# Altium schematic sheet communication.SchDoc
size A4; SheetNumber: 8
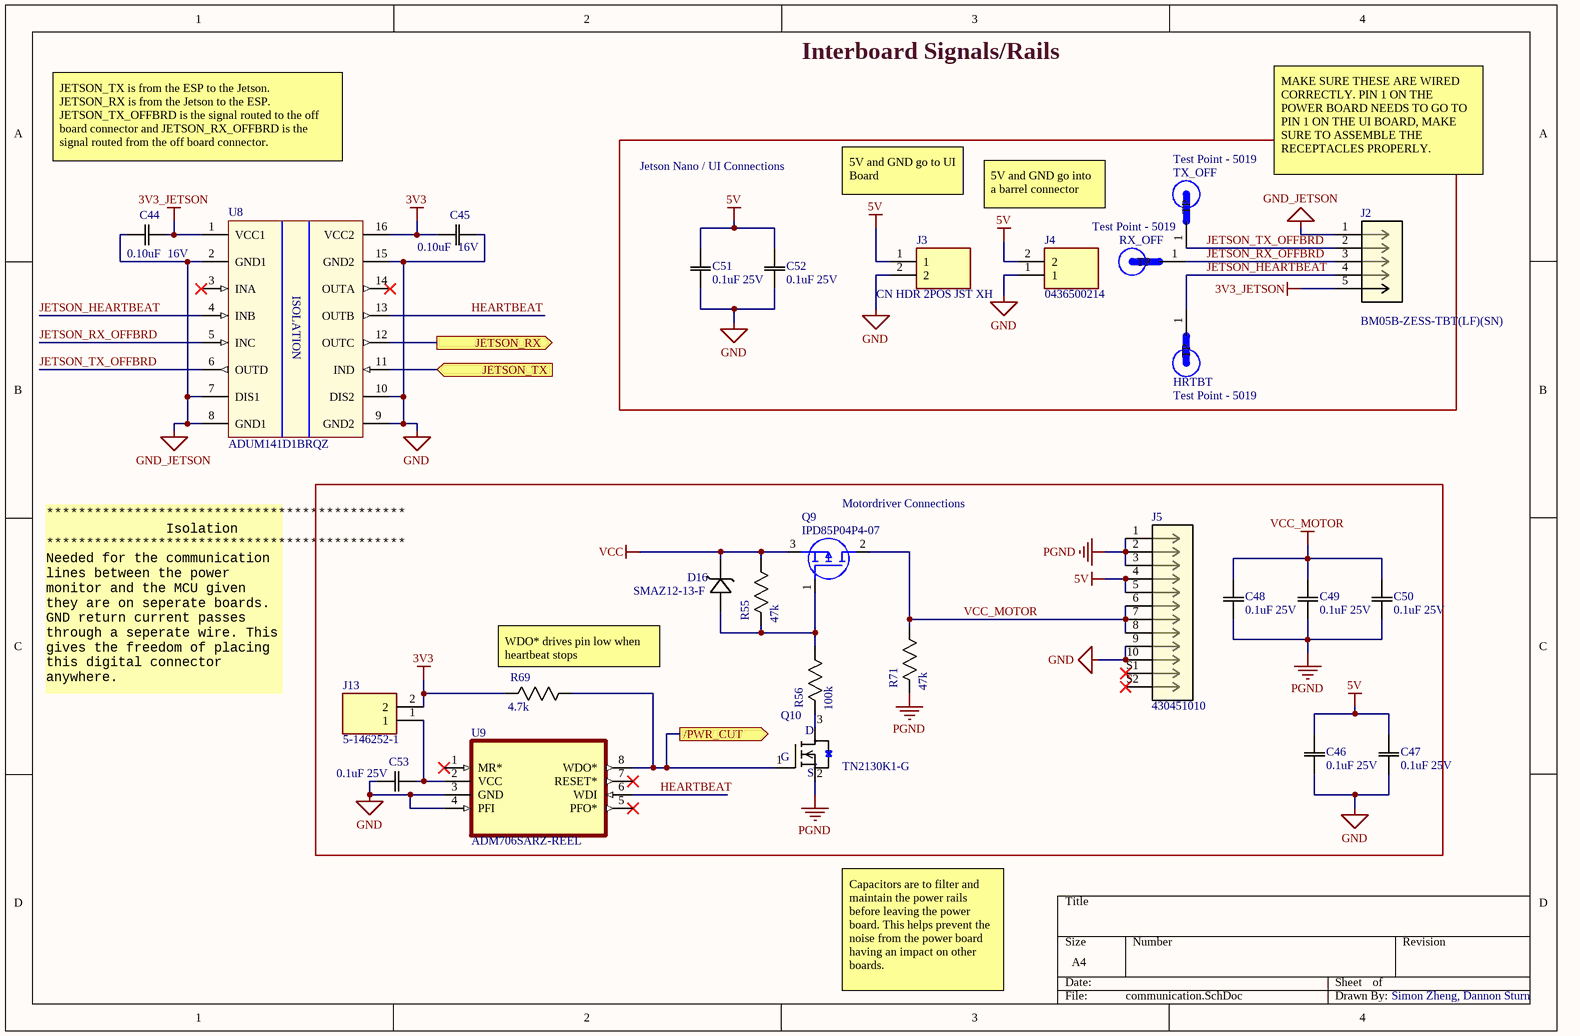
[diagram p0: communication.SchDoc]

## Parts
C44  Rating: 16V  [0603]  (hidden comment: 0.10uF)
C45  Rating: 16V  [0603]  (hidden comment: 0.10uF)
C46  0.1uF 25V  [0603]
C47  0.1uF 25V  [0603]
C48  0.1uF 25V  [0603]
C49  0.1uF 25V  [0603]
C50  0.1uF 25V  [0603]
C51  0.1uF 25V  [0603]
C52  0.1uF 25V  [0603]
C53  0.1uF 25V  [0603]
D16  SMAZ12-13-F  [SMA_DIO-L]
HRTBT  Test Point - 5019  [TP380X203]
J2  BM05B-ZESS-TBT(LF)(SN)  [JST ZE SMT 5POS]
J3  CN HDR 2POS JST XH  [JST_B2B-XH-A(LF)(SN)]
J4  0436500214  [43650-0214]
J5  430451010  [CON_430451010_MOL]
J13  5-146252-1  [TE_5-146252-1]
Q9  IPD85P04P4-07  [DPAK (TO-252)]
Q10  TN2130K1-G  [SOT95P237X112-3N]
R55  47k  [0603]
R56  100k  [0603]
R69  4.7k  [0603]
R71  47k  [0603]
RX_OFF  Test Point - 5019  [TP380X203]
TX_OFF  Test Point - 5019  [TP380X203]
U8  ADUM141D1BRQZ  [SOP64P600X175-16N]
U9  ADM706SARZ-REEL  [SOIC127P600X175-8N]

## Blocks framed on the sheet
Jetson Nano / UI Connections: C51 C52 HRTBT J2-J4 RX_OFF TX_OFF
Motordriver Connections: C46-C50 C53 D16 J5 J13 Q9 Q10 R55 R56 R69 R71 U9

## Ports
/PWR_CUT (out), JETSON_RX (out), JETSON_TX (in)

## Nets
3V3: C45.2(C2) J13.2 R69.2(R2) U8.16(VCC2)
3V3_JETSON: C44.2(C2) J2.5 U8.1(VCC1)
5V: C46.2(C2) C47.2(C2) C51.2(C2) C52.2(C2) J3.1 J4.2 J5.4 J5.5
GND: C45.1(C1) C46.1(C1) C47.1(C1) C51.1(C1) C52.1(C1) C53.1(C1) J3.2 J4.1 J5.9 J5.10 U8.9(GND2) U8.10(DIS2) U8.15(GND2) U9.3(GND) U9.4(PFI)
GND_JETSON: C44.1(C1) J2.1 U8.2(GND1) U8.7(DIS1) U8.8(GND1)
PGND: C48.1(C1) C49.1(C1) C50.1(C1) J5.1 J5.2 J5.3 Q10.2(S) R71.2(R2)
VCC: D16.1 Q9.3(S) R55.1(R1)
VCC_MOTOR: C48.2(C2) C49.2(C2) C50.2(C2) J5.6 J5.7 J5.8 Q9.2(D) R71.1(R1)
/PWR_CUT: Q10.1(G) R69.1(R1) U9.8(WDO*) ; port /PWR_CUT
HEARTBEAT: U8.13(OUTB) U9.6(WDI)
JETSON_HEARTBEAT: HRTBT.1(TP) J2.4 U8.4(INB)
JETSON_RX: U8.12(OUTC) ; port JETSON_RX
JETSON_RX_OFFBRD: J2.3 RX_OFF.1(TP) U8.5(INC)
JETSON_TX: U8.11(IND) ; port JETSON_TX
JETSON_TX_OFFBRD: J2.2 TX_OFF.1(TP) U8.6(OUTD)
NetC53_2: C53.2(C2) J13.1 U9.2(VCC)
NetD16_2: D16.2 Q9.1(G) R55.2(R2) R56.1(R1)
NetQ10_3: Q10.3(D) R56.2(R2)

Not connected (* = marked no-connect by the designer): J5 S1* S2*; U8 3(INA)* 14(OUTA)*; U9 1(MR*)* 5(PFO*)* 7(RESET*)*

## Notes on the sheet
- Interboard Signals/Rails
- JETSON_TX is from the ESP to the Jetson. JETSON_RX is from the Jetson to the ESP.
  JETSON_TX_OFFBRD is the signal routed to the off board connector and JETSON_RX_OFFBRD is the signal routed from the off board connector.
- MAKE SURE THESE ARE WIRED CORRECTLY. PIN 1 ON THE POWER BOARD NEEDS TO GO TO PIN 1 ON THE UI BOARD, MAKE SURE TO ASSEMBLE THE RECEPTACLES PROPERLY.
- 5V and GND go to UI Board
- 5V and GND go into a barrel connector
- *********************************************
  Isolation
  *********************************************
  Needed for the communication lines between the power monitor and the MCU given they are on seperate boards. GND return current passes through a seperate wire. This gives the freedom of placing this digital connector anywhere.
- (near R69) WDO* drives pin low when heartbeat stops
- Capacitors are to filter and maintain the power rails before leaving the power board. This helps prevent the noise from the power board having an impact on other boards.
- Simon Zheng, Dannon Sturn
- (in symbol ISO ADUM141D1BRQZ) ISOLATION

## Library data of the parts
C44 C45 = CAP 0.10uF 16V: CAP CER 0.10UF 16V X5R 0603/0805; Tolerance: 10%; Package: 0603/0805; Temperature Coefficient: X5R; Operating Temperature: -55°C ~ 85°C; Value: 0.10uF
C46-C53 = CAP 0.1uF 25V: CAP CER 0.1UF 25V X7R 0805/0603; Tolerance: 10%; Value: 0.1uF; Temperature Coefficient: X7R; Rating: 25V; Operating Temperature: -55°C ~ 125°C
D16 = DIODE ZENER 12V 1W: Zener Diode 12 V 1 W ±5% Surface Mount SMA; Mfr_Name: Diodes Inc; Type: DEV; Copyright: Copyright (C) 2021 Ultra Librarian. All rights reserved.; Manufacturer_Part_Number: SMAZ12-13-F; Digi-Key_Part_Number_1: SMAZ12-FDICT-ND; Digi-Key_Part_Number_2: SMAZ12-FDIDKR-ND; Digi-Key_Part_Number_3: SMAZ12-FDITR-ND; RefDes: RefDes; Supplier 1: Mouser; Supplier 2: Newark; Supplier 3: Digi-Key; Supplier Part Number 1: 621-SMAZ12-F; Supplier Part Number 2: 23T8541; Supplier Part Number 3: SMAZ12-FDICT-ND
HRTBT RX_OFF TX_OFF = Test Point - 5019: PC Test Point, Miniature Phosphor Bronze, Silver Plating Surface Mount Mounting Type; MP: 5019; MF: Keystone Electronics; Value: *; Package: 2010 Keystone; Digi-Key_Part_Number: 36-5019CT-ND; Digi-Key_Purchase_URL: https://www.digikey.com/product-detail/en/keystone-electronics/5019/36-5019CT-ND/3907344?utm_source=snapeda&utm_medium=aggregator&utm_campaign=symbol
J2 = CN 5POS JST ZE SMT: CONN HEADER VERT SMD 5POS ZE; Supplier 1: Digi-Key; Supplier Part Number 1: 455-2383-1-ND
J3 = CN HDR 2POS JST XH: Connector Header Through Hole 2 position 0.098 _2.50mm_ / JST XH; MP: B2B-XH-A_LF__SN_; MF: JST Sales; Price: None; Package: None; Value: *; Availability: Unavailable; SnapEDA_Link: https://www.snapeda.com/parts/B2B-XH-A%28LF%29%28SN%29/JST%20Sales%20America%20Inc./view-part/492310/?ref=snap
J4 = CN HDR 2POS Molex 0436500214: Connector Header Surface Mount, Right Angle 2 position 0.118" (3.00mm); Manufacturer_Name: Molex; Datasheet Link: http://www.molex.com/webdocs/datasheets/pdf/en-us//0436500214_PCB_HEADERS.pdf; Manufacturer_Part_Number: 43650-0214; Supplier 1: Digi-Key; Supplier 2: Newark; Supplier 3: Arrow Electronics; Supplier 4: Mouser; Supplier Part Number 1: WM14310CT-ND; Supplier Part Number 2: 39AH6218; Supplier Part Number 3: 43650-0214; Supplier Part Number 4: 538-43650-0214
J5 = CN HDR 10POS MOLEX 430451010: Connector Header Surface Mount, Right Angle 10 position 0.118" (3.00mm); Mfr_Name: Molex Connector Corporation; Copyright: Copyright (C) 2021 Ultra Librarian. All rights reserved.; Manufacturer_Part_Number: 430451010; Digi-Key_Part_Number_1: WM3819TR-ND; Digi-Key_Part_Number_2: WM3819CT-ND; Digi-Key_Part_Number_3: WM3819DKR-ND; RefDes: RefDes; Type: DEV; Supplier 1: Digi-Key; Supplier 2: Newark; Supplier 3: Mouser; Supplier Part Number 1: WM3819CT-ND; Supplier Part Number 2: 03AH4054; Supplier Part Number 3: 538-43045-1010
J13 = 5-146252-1: 2 Pin Jumper Male Pins; Package: None; Price: None; Value: *; MP: 5-146252-1; Availability: Unavailable
Q9 = MOSFET IPD85P04P4-07: P-Channel 40 V 85A (Tc) 88W (Tc) Surface Mount PG-TO252-3-313; Supplier 1: Newark; Supplier 2: Mouser; Supplier 3: Digi-Key; Supplier Part Number 1: 51AH5912; Supplier Part Number 2: 726-IPD85P04P4-07; Supplier Part Number 3: 448-IPD85P04P407ATMA1CT-ND
Q10 = MOSFET N-CH TN2130K1-G: N-Channel 300 V 85mA (Tj) 360mW (Tc) Surface Mount TO-236AB (SOT23); Mfr_Name: Microchip; Type: DEV; Copyright: Copyright (C) 2021 Ultra Librarian. All rights reserved.; Manufacturer_Part_Number: TN2130K1-G; Digi-Key_Part_Number_1: TN2130K1-GCT-ND; Digi-Key_Part_Number_2: TN2130K1-GDKR-ND; Digi-Key_Part_Number_3: TN2130K1-GTR-ND; RefDes: RefDes; Supplier 1: Digi-Key; Supplier Part Number 1: TN2130K1-GCT-ND
R55 R71 = RES 47k 1/8W - 5%: RES SMD 47k OHM 5% 1/8W 0805; Power (Watts): 0.125W; Package: 0805; Value: 47k; Tolerance: 5%
R56 = RES 100k 1/8W - 5%: RES SMD 100K OHM 5% 1/8W 0805/0603; Power (Watts): 0.125W; Package: 0805; Value: 100k; Tolerance: 5%
R69 = RES 4.7k 1/8W - 5%: RES SMD 4.7k OHM 5% 1/8W 0805; Power (Watts): 0.125W; Package: 0805; Value: 4.7k; Tolerance: 5%
U8 = ISO ADUM141D1BRQZ: Digital Isolator CMOS 4-CH 150Mbps 16-Pin QSOP T/R; Manufacturer: Analog Devices; Manufacturer Part Number: ADUM141D1BRQZ-RL7; Isolated Power: No; Number of Channels: 4; Channel Type: Unidirectional; Propagation Delay: 13ns; Pulse Width Distortion (PWD): 3ns; Supplier 1: Arrow Electronics; RoHS: Yes; Category: Interface ICs; Stock 1: 341; Pricing 1: 1=3.87700, 10=3.47000, 25=3.26100, 50=3.22900, 100=2.78500, 250=2.67500 (USD); Mount: Surface Mount; Case/Package: SSOP; Number of Pins: 16; Min Operating Temperature: -40°C; Max Operating Temperature: 125°C; Type: General Purpose; Packaging: Tape and Reel; Data Rate: 150Mbps; RoHS Compliant: Yes; ComponentLink1URL: https://www.analog.com/media/en/technical-documentation/data-sheets/ADuM140D_140E_141D_141E_142D_142E.pdf?src-supplier=Digi-Key; ComponentLink1Description: https://www.analog.com/media/en/technical-documentation/data-sheets/ADuM140D_140E_141D_141E_142D_142E.pdf?src-supplier=Digi-Key; Supplier Part Number 1: ADUM141D1BRQZ-RL7
U9 = ADM706SARZ-REEL: Supervisor Push-Pull, Totem Pole 1 Channel 8-SOIC; MF: Analog Devices; MP: ADM706SARZ-REEL; Package: SOIC-8 Analog Devices; Value: *; SnapEDA_Link: https://www.snapeda.com/parts/ADM706SARZ-REEL/Analog+Devices/view-part/?ref=snap; Digi-Key_Part_Number: ADM706SARZ-REELCT-ND; Check_prices: https://www.snapeda.com/parts/ADM706SARZ-REEL/Analog+Devices/view-part/?ref=eda; Purchase-URL: https://pricing.snapeda.com/search/part/ADM706SARZ-REEL/?ref=eda; Supplier 1: Digi-Key; Supplier 2: Arrow Electronics; Supplier 3: Mouser; Supplier Part Number 1: ADM706SARZ-REELCT-ND; Supplier Part Number 2: ADM706SARZ-REEL; Supplier Part Number 3: 584-ADM706SARZ-R